# Altium project PCB_Master_DMX.PrjPcb
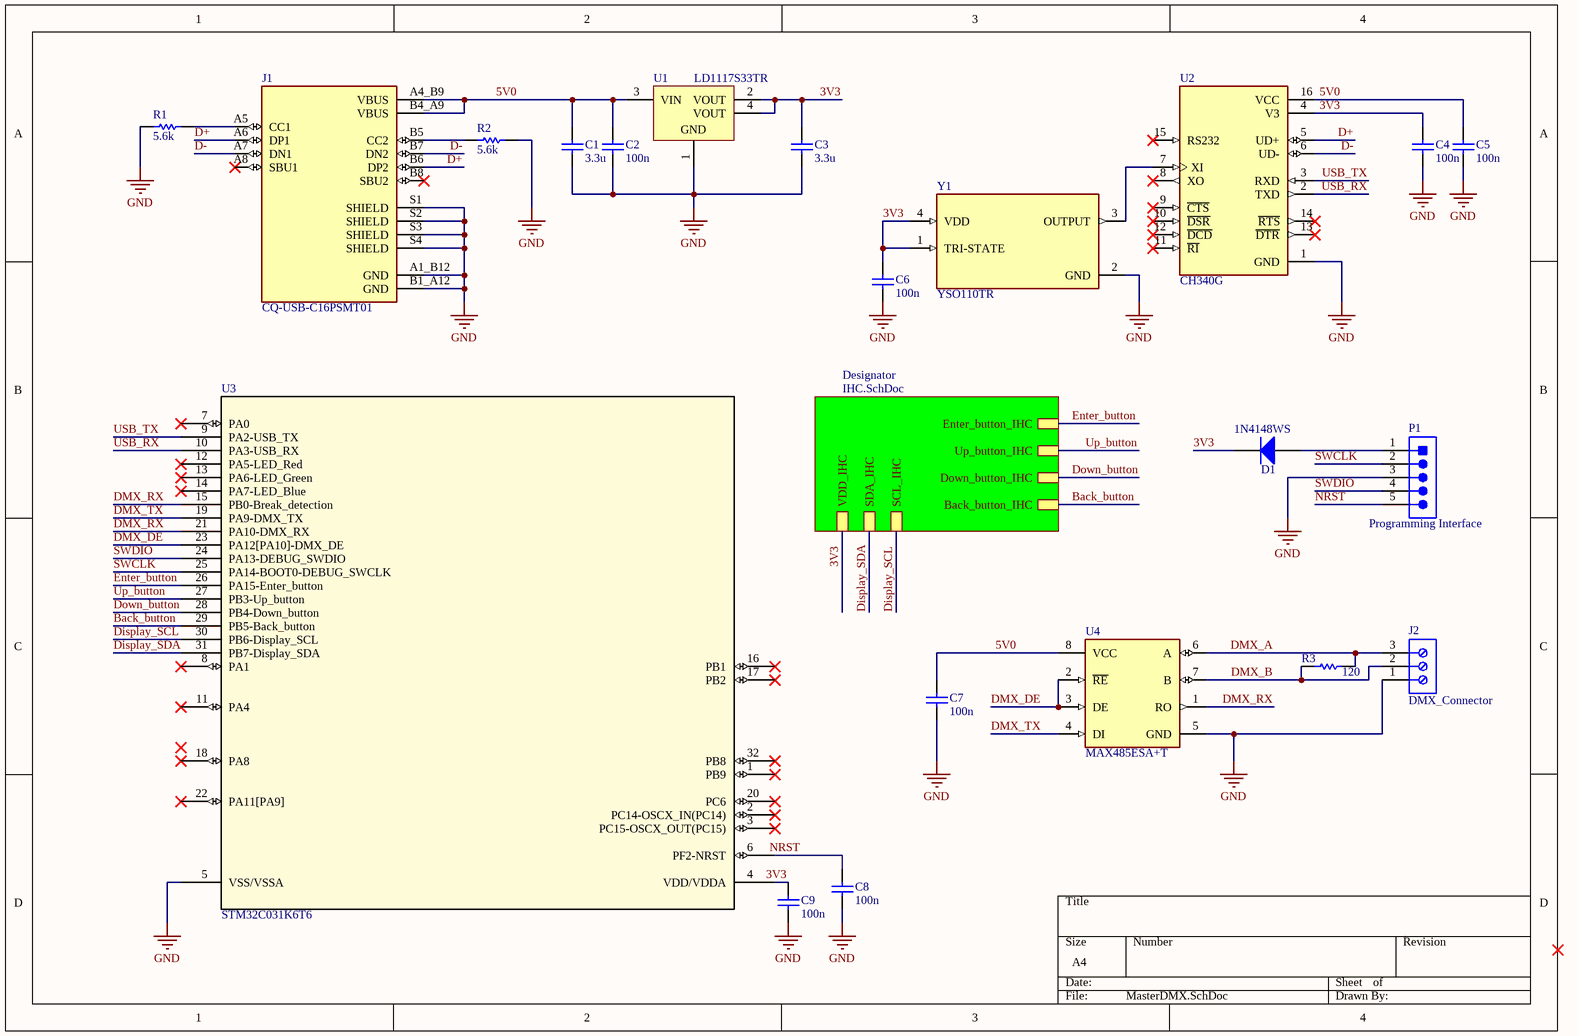
[diagram p0: MasterDMX.SchDoc]
2 sheets, 44 parts. Net scope: hierarchical (ports join the sheet entries above them; power ports are global).
Board files: MasterDMX.PcbDoc, PCB_Panel.PcbDoc
Sheets:
  MasterDMX.SchDoc
    Designator = IHC.SchDoc

## Sheet MasterDMX.SchDoc
size A4; SheetNumber: 1; SheetTotal: 2; SPICEModelCacheMFUPUCCV: <root> / <DocumentId>MFUPUCCV</DocumentId> / <CacheFrame Number="0"> / <Model Name="res" Kind="MDL"> / <Text>*Default semiconductor resistor / .MODEL RES R()</Text> / </Model> / <Model Name="cap" Kind="MDL"> / <Text>*Default semiconductor capacitor / .MODEL CAP C()</Text> / </Model> / </CacheFrame> / </root>

### Parts
C1  3.3u  [C2012[0805]]
C2  100n  [C3216[1206]]
C3  3.3u  [C2012[0805]]
C4  100n  [C3216[1206]]
C5  100n  [C3216[1206]]
C6  100n  [C3216[1206]]
C7  100n  [C3216[1206]]
C8  100n  [C3216[1206]]
C9  100n  [C3216[1206]]
D1  1N4148WS  [FAIR-SOD-323_V]
J1  CQ-USB-C16PSMT01  [SHENZHEN-CHUANGQIN-TECHNOLOGY_CQ-USB-C16PSMT01]
J2  DMX_Connector  [691214110003]
P1  Programming Interface  [FCI-77311-5_V]
R1  5.6k  [R2012[0805]]
R2  5.6k  [R2012[0805]]
R3  120  [R2012[0805]]
U1  LD1117S33TR  [STM-SOT-223_M]
U2  CH340G  [SOIC127P600X180-16N]
U3  STM32C031K6T6  [LQFP32_7X7_STM]
U4  MAX485ESA+T  [FP-S8-2-MFG]
Y1  YSO110TR  [OSC_ECS-TXO-2016-33-120-TR]

### Sub-sheets
Designator = IHC.SchDoc: SDA_IHC, SCL_IHC, VDD_IHC, Back_button_IHC, Down_button_IHC, Up_button_IHC, Enter_button_IHC

### Nets
GND: C1.1 C2.1 C3.1 C4.1 C5.1 C6.1 C7.1 C8.1 C9.1 J1.A1_B12(GND) J1.B1_A12(GND) J1.S1(SHIELD) J1.S2(SHIELD) J1.S3(SHIELD) J1.S4(SHIELD) J2.1 P1.3(TXO) R1.1 R2.2 U1.1(GND) U2.1(GND) U3.5(VSS/VSSA) U4.5(GND) Y1.2(GND)
3V3: C3.2 C4.2 C6.2 C9.2 D1.2(K) U1.2(VOUT) U1.4(VOUT) U2.4(V3) U3.4(VDD/VDDA) Y1.1(TRI-STATE) Y1.4(VDD) ; sheet Designator/VDD_IHC
5V0: C1.2 C2.2 C5.2 C7.2 J1.A4_B9(VBUS) J1.B4_A9(VBUS) U1.3(VIN) U2.16(VCC) U4.8(VCC)
Back_button: U3.29(PB5-Back_button) ; sheet Designator/Back_button_IHC
D+: J1.A6(DP1) J1.B6(DP2) U2.5(UD+)
D-: J1.A7(DN1) J1.B7(DN2) U2.6(UD-)
Display_SCL: U3.30(PB6-Display_SCL) ; sheet Designator/SCL_IHC
Display_SDA: U3.31(PB7-Display_SDA) ; sheet Designator/SDA_IHC
DMX_A: J2.3 R3.1 U4.6(A)
DMX_B: J2.2 R3.2 U4.7(B)
DMX_DE: U3.23(PA12[PA10]-DMX_DE) U4.2(~{RE}) U4.3(DE)
DMX_RX: U3.15(PB0-Break_detection) U3.21(PA10-DMX_RX) U4.1(RO)
DMX_TX: U3.19(PA9-DMX_TX) U4.4(DI)
Down_button: U3.28(PB4-Down_button) ; sheet Designator/Down_button_IHC
Enter_button: U3.26(PA15-Enter_button) ; sheet Designator/Enter_button_IHC
NRST: C8.2 P1.5(CTS) U3.6(PF2-NRST)
SWCLK: P1.2(RXI) U3.25(PA14-BOOT0-DEBUG_SWCLK)
SWDIO: P1.4(VCC) U3.24(PA13-DEBUG_SWDIO)
Up_button: U3.27(PB3-Up_button) ; sheet Designator/Up_button_IHC
USB_RX: U2.2(TXD) U3.10(PA3-USB_RX)
USB_TX: U2.3(RXD) U3.9(PA2-USB_TX)
NetD1_1: D1.1(A) P1.1(DTR)
NetJ1_A5: J1.A5(CC1) R1.2
NetJ1_B5: J1.B5(CC2) R2.1
NetU2_7: U2.7(XI) Y1.3(OUTPUT)

Not connected (* = marked no-connect by the designer): J1 A8(SBU1)* B8(SBU2)*; U2 8(XO)* 9(~{CTS})* 10(~{DSR})* 11(~{RI})* 12(~{DCD})* 13(~{DTR})* 14(~{RTS})* 15(RS232)*; U3 1(PB9)* 2(PC14-OSCX_IN(PC14))* 3(PC15-OSCX_OUT(PC15))* 7(PA0)* 8(PA1)* 11(PA4)* 12(PA5-LED_Red)* 13(PA6-LED_Green)* 14(PA7-LED_Blue)* 16(PB1)* 17(PB2)* 18(PA8)* 20(PC6)* 22(PA11[PA9])* 32(PB8)*

### Library data of the parts
C1-C9 = C: Capacitor; Value: 1; Manufacturer: *; PartNumber: *; Package Type: *
D1 = CMP-004-00001-2: Small Signal Diode, 75 V, 0.15 A, -55 to 150 degC, 2-Pin SOD-323, RoHS, Tape and Reel; Manufacturer: Fairchild; Recovery Time: 4ns; Forward Voltage: 1V; Peak Reverse Current: 5uA; Forward Current: 150mA; Capacitance: -323f; Datasheet URL: https://www.fairchildsemi.com/datasheets/1N/1N4148WS.pdf; Package Reference: SOD-323; Package Description: 2-Pin Small Outline Diode Flat Lead, Body 1.7 x 1.25 mm; Case/Package: SOD-323; Mounting Technology: SM; Manufacturer URL: https://www.fairchildsemi.com/; Pins: 2; Packaging: TapeandReel; Package Quantity: 3000; Min Operating Temperature: -55°C; RoHS Compliant: True; Max Operating Temperature: 150°C; Datasheet Version: Rev. 1.2, 03/2015
J1 = CQ-USB-C16PSMT01: C Type USB Type-C Female Plug 16 Pin Connector Power Charger Jack Port; MF: Shenzen Chuangqin Technology; MP: CQ-USB-C16PSMT01; Price: None; Package: Package; Availability: Unavailable; SnapEDA_Link: https://www.snapeda.com/parts/CQ-USB-C16PSMT01/Shenzen%20Chuangqin%20Technology/view-part/5798994/?ref=snap; Check_prices: https://www.snapeda.com/parts/CQ-USB-C16PSMT01/Shenzen%20Chuangqin%20Technology/view-part/5798994/?ref=eda; Value: *
J2 = CMP-1502-02466-2: NexarPartId: 18818289; Number of Levels: 1; Voltage: 300V; Pitch: 3.5052mm; Stripping Length: -6mm; Number of Positions Per Level: 3; Plating: Brass, Steel; Wire/Cable Gauge: 24AWG; Wire Gauge (Min): 16AWG; Current Rating: 10A; Width: 10.9mm; Length: 7.4mm; Housing Material: Nylon; Height: 12.2mm; Min Operating Temperature: -40°C; Contact Plating: Brass, Tin; Packaging: Box; Color: Blue, Green; Number of Contacts: 3; Number of Pins: 3; Voltage Rating: 300V; Termination: Screw; Lead Pitch: 3.5mm; Max Operating Temperature: 105°C; Mount: Through Hole; Contact Material: Brass; RoHS: Compliant; Wire Gauge (Max): 24AWG; Current: 10A; REACH SVHC: Unknown
P1 = CMP-002-00021-2: Male Header, Pitch 2.54 mm, 1 x 5 Position, Height 16.24 mm, Tail Length 3.05 mm, -65 to 125 degC, RoHS, Tape and Reel; Manufacturer: FCI Electronics; Connector Type: Header; Manufacturer URL: http://portal.fciconnect.com/; Datasheet URL: http://portal.fciconnect.com/Comergent//fci/drawing/77311.pdf; Gender: Male; Case/Package: 77311-5; Package Reference: 77311-5; Datasheet Version: Rev. CK, 07/2016; Package Description: Male Header, Pitch 2.54 mm, 1 x 5 Position, Height 16.24 mm, Tail Length 3.05 mm; RoHS Compliant: Unknown; Mounting Technology: TH
R1-R3 = R: Resistor; Value: 0; Manufacturer: *; PartNumber: *; Package Type: *
U1 = CMP-019-00019-3: Low Drop Positive Voltage Regulator, 800 mA, Fixed 3.3 V Output, 0 to 125 degC, 3-Pin TO-220, RoHS, Tape and Reel; Manufacturer: STMicroelectronics; Max Supply Voltage: 15V; Dropout Voltage: 1.1V; Power: 12W; Output Current: 950mA; Min Input Voltage: 4.75V; Nominal Output Voltage: 3.3V; Max Ouput Current: 1.3A; Outputs: 1; Packaging: TapeandReel; Datasheet Version: Rev. 33, 11/2013; RoHS Compliant: True; Mounting Technology: SM; Max Input Voltage: 15V; Max Operating Temperature: 125°C; Package Reference: SOT-223; Package Quantity: 2500; Package Description: 4-Pin Small Outline Transistor, Body 6.5 x 3.5 mm, Pitch 2.3 mm; Case/Package: TO-261-4; Min Operating Temperature: 0°C; Datasheet URL: http://www.farnell.com/datasheets/1776449.pdf; Min Supply Voltage: 4.75V; Pins: 3; Output Voltage: 3.3V; Manufacturer URL: http://www.st.com/
U2 = CH340G: USB Interface Integrated Circuit; MF: WCH; Value: *; SnapEDA_Link: https://www.snapeda.com/parts/Ch340G/WCH/view-part/?ref=snap; MP: Ch340G; Check_prices: https://www.snapeda.com/parts/Ch340G/WCH/view-part/?ref=eda; Availability: Not in stock; Price: None; Package: None
U3 = STM32C031K6T6: No Description Available; Mfr_Name: STMicroelectronics; RefDes: RefDes; Type: Type
U4 = CMP-015-00008-1: Line Transceiver, 1 Func, 1 Driver, 1 Rcvr, CMOS, PDSO8; Max Supply Voltage: 5.25V; Min Supply Voltage: 4.75V; RoHS Compliant: Yes; Max Operating Temperature: 85°C; Min Operating Temperature: -40°C
Y1 = CMP-003-000000-1: MP: ECS-TXO-2016-33-120-TR; Source: ECS-TXO-2016-33-120-TR.SchLib; Price: None; Design Item ID: ECS-TXO-2016-33-120-TR; Package: None; Value: *; Availability: Unavailable; Component Type: Standard; Pin Count: 4

## Sheet IHC.SchDoc
size A4; SheetNumber: 2; SheetTotal: 2
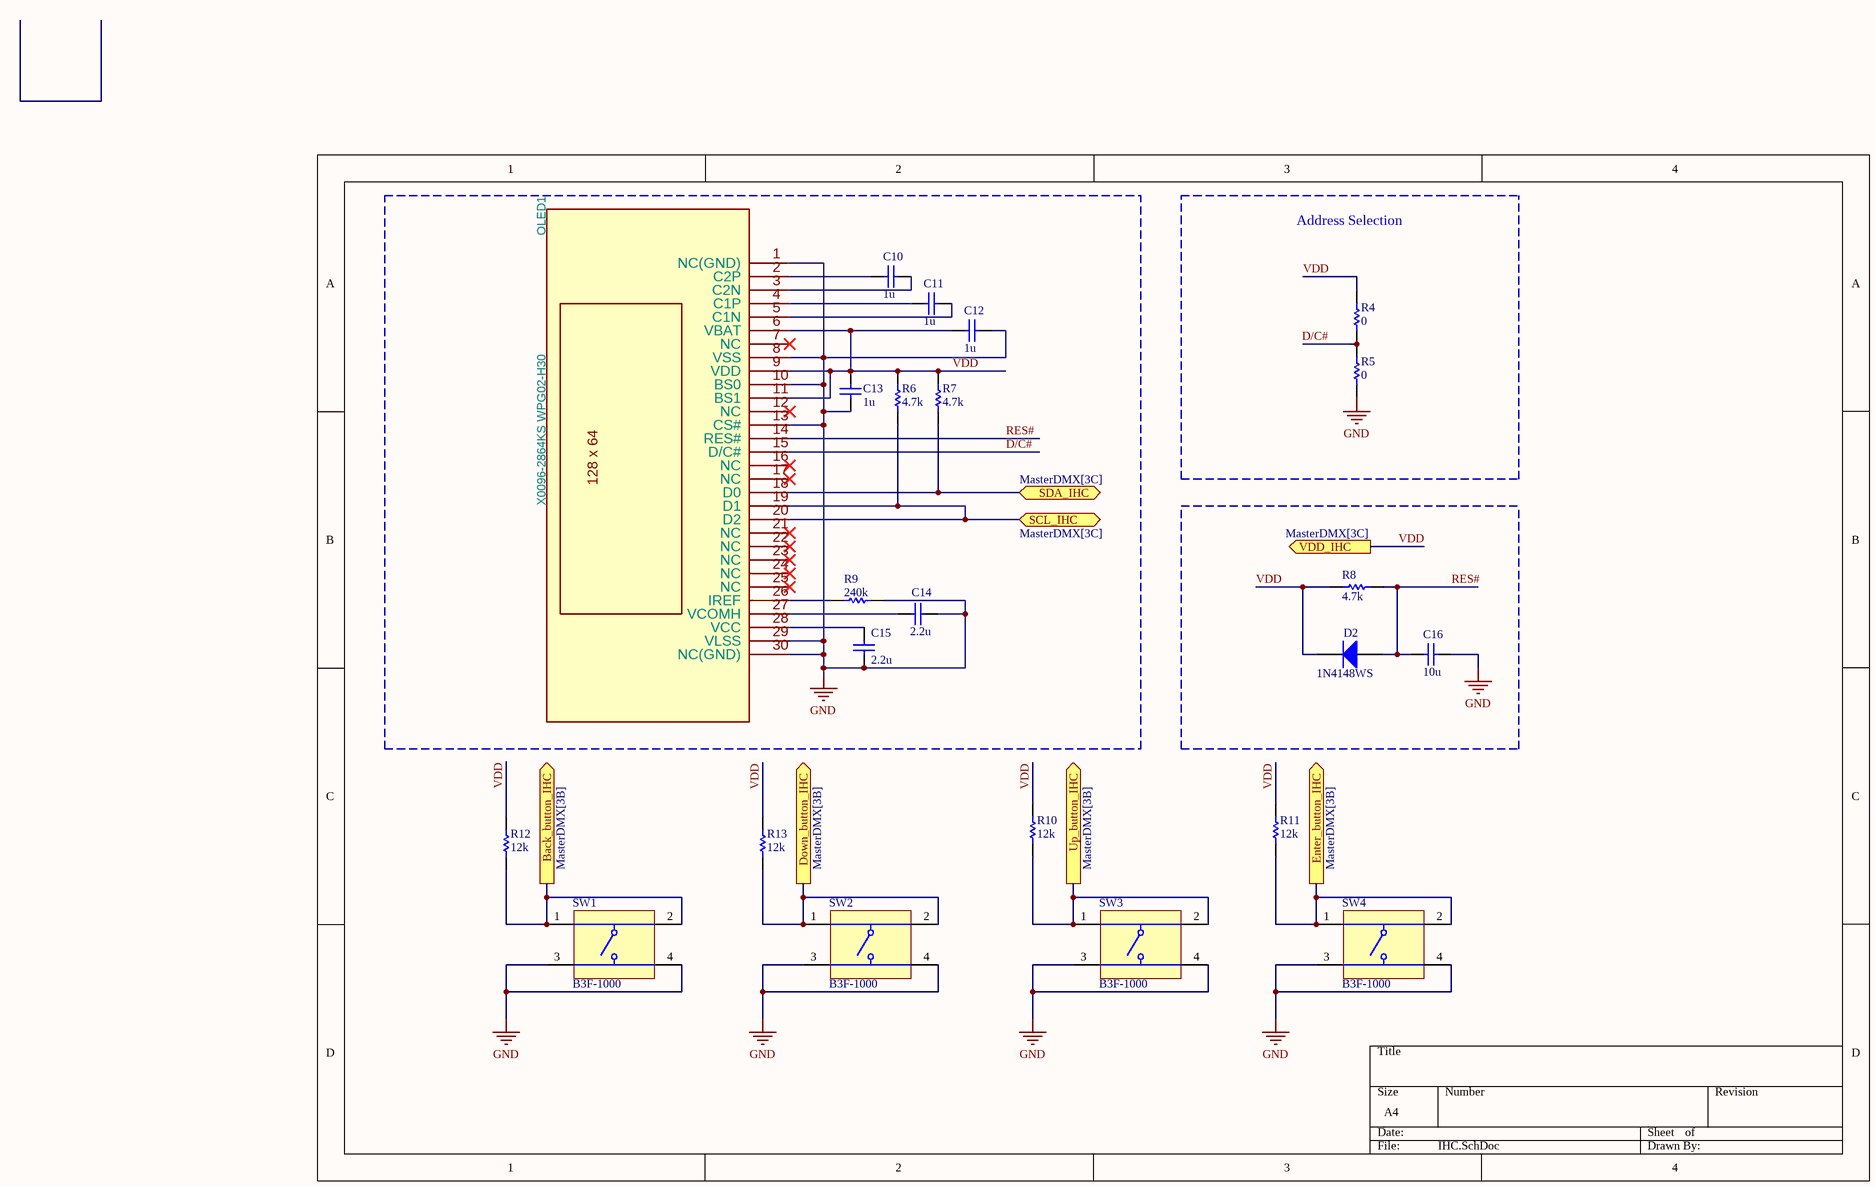
[diagram p1: IHC.SchDoc]

### Parts
C10  1u  [C2012[0805]]
C11  1u  [C2012[0805]]
C12  1u  [C2012[0805]]
C13  1u  [C2012[0805]]
C14  2.2u  [C2012[0805]]
C15  2.2u  [C2012[0805]]
C16  10u  [C2012[0805]]
D2  1N4148WS  [FAIR-SOD-323_V]
OLED1  X0096-2864KS WPG02-H30  [SSD1315_0.96in_30P]
R4  0  [R2012[0805]]
R5  0  [R2012[0805]]
R6  4.7k  [R2012[0805]]
R7  4.7k  [R2012[0805]]
R8  4.7k  [R2012[0805]]
R9  240k  [R2012[0805]]
R10  12k  [R2012[0805]]
R11  12k  [R2012[0805]]
R12  12k  [R2012[0805]]
R13  12k  [R2012[0805]]
SW1  B3F-1000  [OMRON-B3F-1000-4_V]
SW2  B3F-1000  [OMRON-B3F-1000-4_V]
SW3  B3F-1000  [OMRON-B3F-1000-4_V]
SW4  B3F-1000  [OMRON-B3F-1000-4_V]

### Blocks framed on the sheet
Address Selection: R4 R5

### Ports
Back_button_IHC (out, see MasterDMX[3B]), Down_button_IHC (out, see MasterDMX[3B]), Enter_button_IHC (out, see MasterDMX[3B]), SCL_IHC (bidir, see MasterDMX[3C]), SDA_IHC (bidir, see MasterDMX[3C]), Up_button_IHC (out, see MasterDMX[3B]), VDD_IHC (out, see MasterDMX[3C])

### Nets
GND: C12.1 C13.2 C14.1 C15.2 C16.1 OLED1.1(NC(GND)) OLED1.8(VSS) OLED1.10(BS0) OLED1.13(CS#) OLED1.29(VLSS) OLED1.30(NC(GND)) R5.1 R9.2 SW1.3 SW1.4 SW2.3 SW2.4 SW3.3 SW3.4 SW4.3 SW4.4
Back_button: R12.1 SW1.1 SW1.2 ; port Back_button_IHC
D/C#: OLED1.15(D/C#) R4.1 R5.2
Display_SCL: OLED1.19(D1) OLED1.20(D2) R6.1 ; port SCL_IHC
Display_SDA: OLED1.18(D0) R7.1 ; port SDA_IHC
Down_button: R13.1 SW2.1 SW2.2 ; port Down_button_IHC
Enter_button: R11.1 SW4.1 SW4.2 ; port Enter_button_IHC
RES#: C16.2 D2.1(A) OLED1.14(RES#) R8.1
Up_button: R10.1 SW3.1 SW3.2 ; port Up_button_IHC
VDD: C12.2 C13.1 D2.2(K) OLED1.6(VBAT) OLED1.9(VDD) OLED1.11(BS1) R4.2 R6.2 R7.2 R8.2 R10.2 R11.2 R12.2 R13.2 ; port VDD_IHC  [project net 3V3]
NetC10_1: C10.1 OLED1.3(C2N)
NetC10_2: C10.2 OLED1.2(C2P)
NetC11_1: C11.1 OLED1.5(C1N)
NetC11_2: C11.2 OLED1.4(C1P)
NetC14_2: C14.2 OLED1.27(VCOMH)
NetC15_1: C15.1 OLED1.28(VCC)
NetOLED1_26: OLED1.26(IREF) R9.1

Not connected (* = marked no-connect by the designer): OLED1 7(NC)* 12(NC)* 16(NC)* 17(NC)* 21(NC)* 22(NC)* 23(NC)* 24(NC)* 25(NC)*

### Notes on the sheet
- (in symbol VG-2864KSWEG01-) 128 x 64

### Library data of the parts
C10-C16 = C: Capacitor; Value: 1; Manufacturer: *; PartNumber: *; Package Type: *
D2 = CMP-004-00001-2: as D1 on sheet MasterDMX; Datasheet URL: https://www.fairchildsemi.com/datasheets/1N/1N4148WS.pdf; Package Reference: SOD-323; Package Description: 2-Pin Small Outline Diode Flat Lead, Body 1.7 x 1.25 mm; Case/Package: SOD-323; Mounting Technology: SM; Manufacturer URL: https://www.fairchildsemi.com/; Pins: 2; Packaging: TapeandReel; Package Quantity: 3000; Min Operating Temperature: -55°C; RoHS Compliant: True; Max Operating Temperature: 150°C; Datasheet Version: Rev. 1.2, 03/2015
OLED1 = VG-2864KSWEG01-: Value: X0096-2864KS WPG02-H30; Footprint: PCB_display_Kicad:OLED 128X64
R4 R5 = R: Resistor; Manufacturer: *; PartNumber: *; Package Type: *; Value: 0
R6-R13 = R: Resistor; Value: 0; Manufacturer: *; PartNumber: *; Package Type: *
SW1-SW4 = CMP-011-00004-2: Tactile Switch, SPST-NO, 0.05 A, 24 V, -25 to 70 degC, 4-Pin THD, RoHS, Bulk; Manufacturer: Omron Electronic Components; Throw Configuration: SPST; Max Contact Resistance: 100mohm; Resistance: 0.1Ohm; Max Current Rating: 50mA; Voltage Rating: 24V; Operating Force: 100gf; Datasheet Version: Jan-15; Case/Package: B3F-1000; Packaging: Bulk; Package Description: 4-Pin Through Hole Device, Body 6 x 6 mm; Manufacturer URL: http://www.omron.com/; Package Reference: B3F-1000; Contact Plating: Gold; Contact Current Rating: 50mA; RoHS Compliant: True; Contact Material: Gold; Mounting Technology: TH; Max Operating Temperature: 70°C; Min Operating Temperature: -25°C; Package Quantity: 1500; Datasheet URL: http://www.omron.com/ecb/products/pdf/en-b3f.pdf; Voltage Rating (DC): 24V; Pins: 4; Current Rating: 50mA; Max Voltage Rating (DC): 24V

## Nets that join several sheets
GND: MasterDMX (24 pins), IHC (21 pins)
3V3: MasterDMX (11 pins), IHC (14 pins)
Back_button: MasterDMX (U3.29), IHC (R12.1 SW1.1 SW1.2)
Display_SCL: MasterDMX (U3.30), IHC (OLED1.19 OLED1.20 R6.1)
Display_SDA: MasterDMX (U3.31), IHC (OLED1.18 R7.1)
Down_button: MasterDMX (U3.28), IHC (R13.1 SW2.1 SW2.2)
Enter_button: MasterDMX (U3.26), IHC (R11.1 SW4.1 SW4.2)
Up_button: MasterDMX (U3.27), IHC (R10.1 SW3.1 SW3.2)